# Altium project TFT_project.PrjPcb
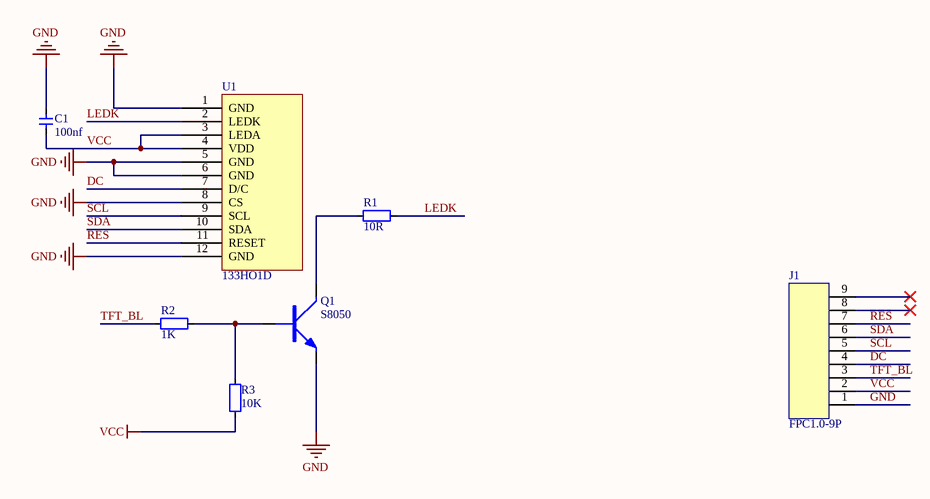
[diagram p0: TFT.SchDoc]
1 sheet, 7 parts. Net scope: global (net labels, ports and power ports of the same name join across sheets).
Board file: TFT.PcbDoc

## Sheet TFT.SchDoc
size A4

### Parts
C1  100nf  [0603C]
J1  FPC1.0-9P  [FPC1.0-9P]
Q1  S8050  [SOT-23]
R1  10R  [0603R]
R2  1K  [0603R]
R3  10K  [0603R]
U1  133HO1D  [LCD-240X240-NOHOLE]

### Nets
GND: C1.2 J1.1 Q1.E U1.1(GND) U1.5(GND) U1.6(GND) U1.8(CS) U1.12(GND)
VCC: C1.1 J1.2 R3.1 U1.3(LEDA) U1.4(VDD)
DC: J1.4 U1.7(D/C)
LEDK: R1.2 U1.2(LEDK)
RES: J1.7 U1.11(RESET)
SCL: J1.5 U1.9(SCL)
SDA: J1.6 U1.10(SDA)
TFT_BL: J1.3 R2.1
NetQ1_B: Q1.B R2.2 R3.2
NetQ1_C: Q1.C R1.1

Not connected (* = marked no-connect by the designer): J1 8* 9*

### Library data of the parts
C1 = CAP: 无极性电容
J1 = FPC1.0-9P: 贴片
Q1 = NPN: NPN三极管
R1-R3 = RES
U1 = 133HO1D: 1.3 TFT IPS